# Altium schematic sheet Converter.SchDoc
size A4; PageSetup: Record=PageOptions|CenterHorizontal=True|CenterVertical=True|PrintScale=1.00|XCorrection=1.00|YCorrection=1.00|PrintKind=0|BorderSize=5000000|LeftOffset=0|BottomOffset=0|Orientation=2|PaperLength=1000|PaperWidth=1000|Scale=100|PaperSource=7|PrintQuality=-4|MediaType=1|DitherType=10|PaperKind=A4|PrintScaleMode=1
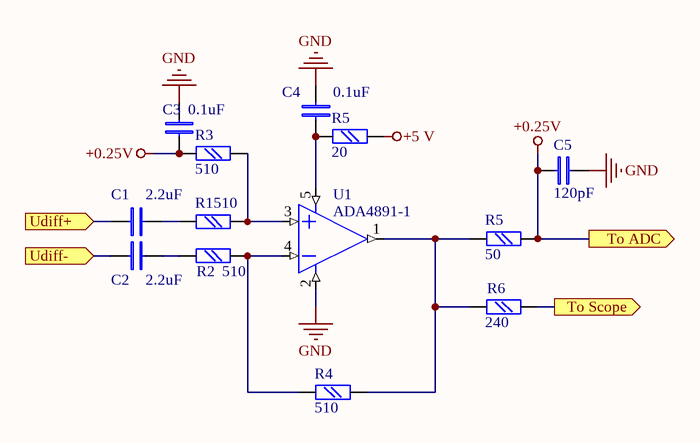
[diagram p0: Converter.SchDoc]

## Parts
(Parts that share a designator on the sheet are numbered #1, #2 ... from top to bottom, then left to right.)
C1  2.2uF  [chip0603]
C2  2.2uF  [chip0603]
C3  0.1uF  [chip0603]
C4  0.1uF  [chip0603]
C5  120pF  [chip0603]
R1  510  [chip0603]
R2  510  [chip0603]
R3  510  [chip0603]
R4  510  [chip0603]
R5#1  20  [chip0603]
R5#2  50  [chip0603]
R6  240  [chip0603]
U1  ADA4891-1  [SOT23-5]

## Ports
To ADC (out), To Scope (out), Udiff+ (in), Udiff- (in)

## Nets
+0.25V: C3.2 C5.2 R3.2 R5#2.2 ; port To ADC
+5 V: R5#1.1
GND: C3.1 C4.1 C5.1 U1.2(E-)
To Scope: R6.2 ; port To Scope
Udiff+: C1.1 ; port Udiff+
Udiff-: C2.1 ; port Udiff-
NetC1_2: C1.2 R1.1
NetC2_2: C2.2 R2.1
NetC4_2: C4.2 R5#1.2 U1.5(E+)
NetR1_2: R1.2 R3.1 U1.3(+IN)
NetR2_2: R2.2 R4.1 U1.4(-IN)
NetR4_2: R4.2 R5#2.1 R6.1 U1.1(OUT)

## Library data of the parts
C1-C5 = C: Text Field1: 20; Text Field2: 10
R1-R4 R5#2 R6 = R: Text Field1: 20; Text Field2: 20
R5#1 = R: Text Field1: 20; Text Field2: 20
U1 = AD8005ART: Text Field1: 40; Text Field2: 40